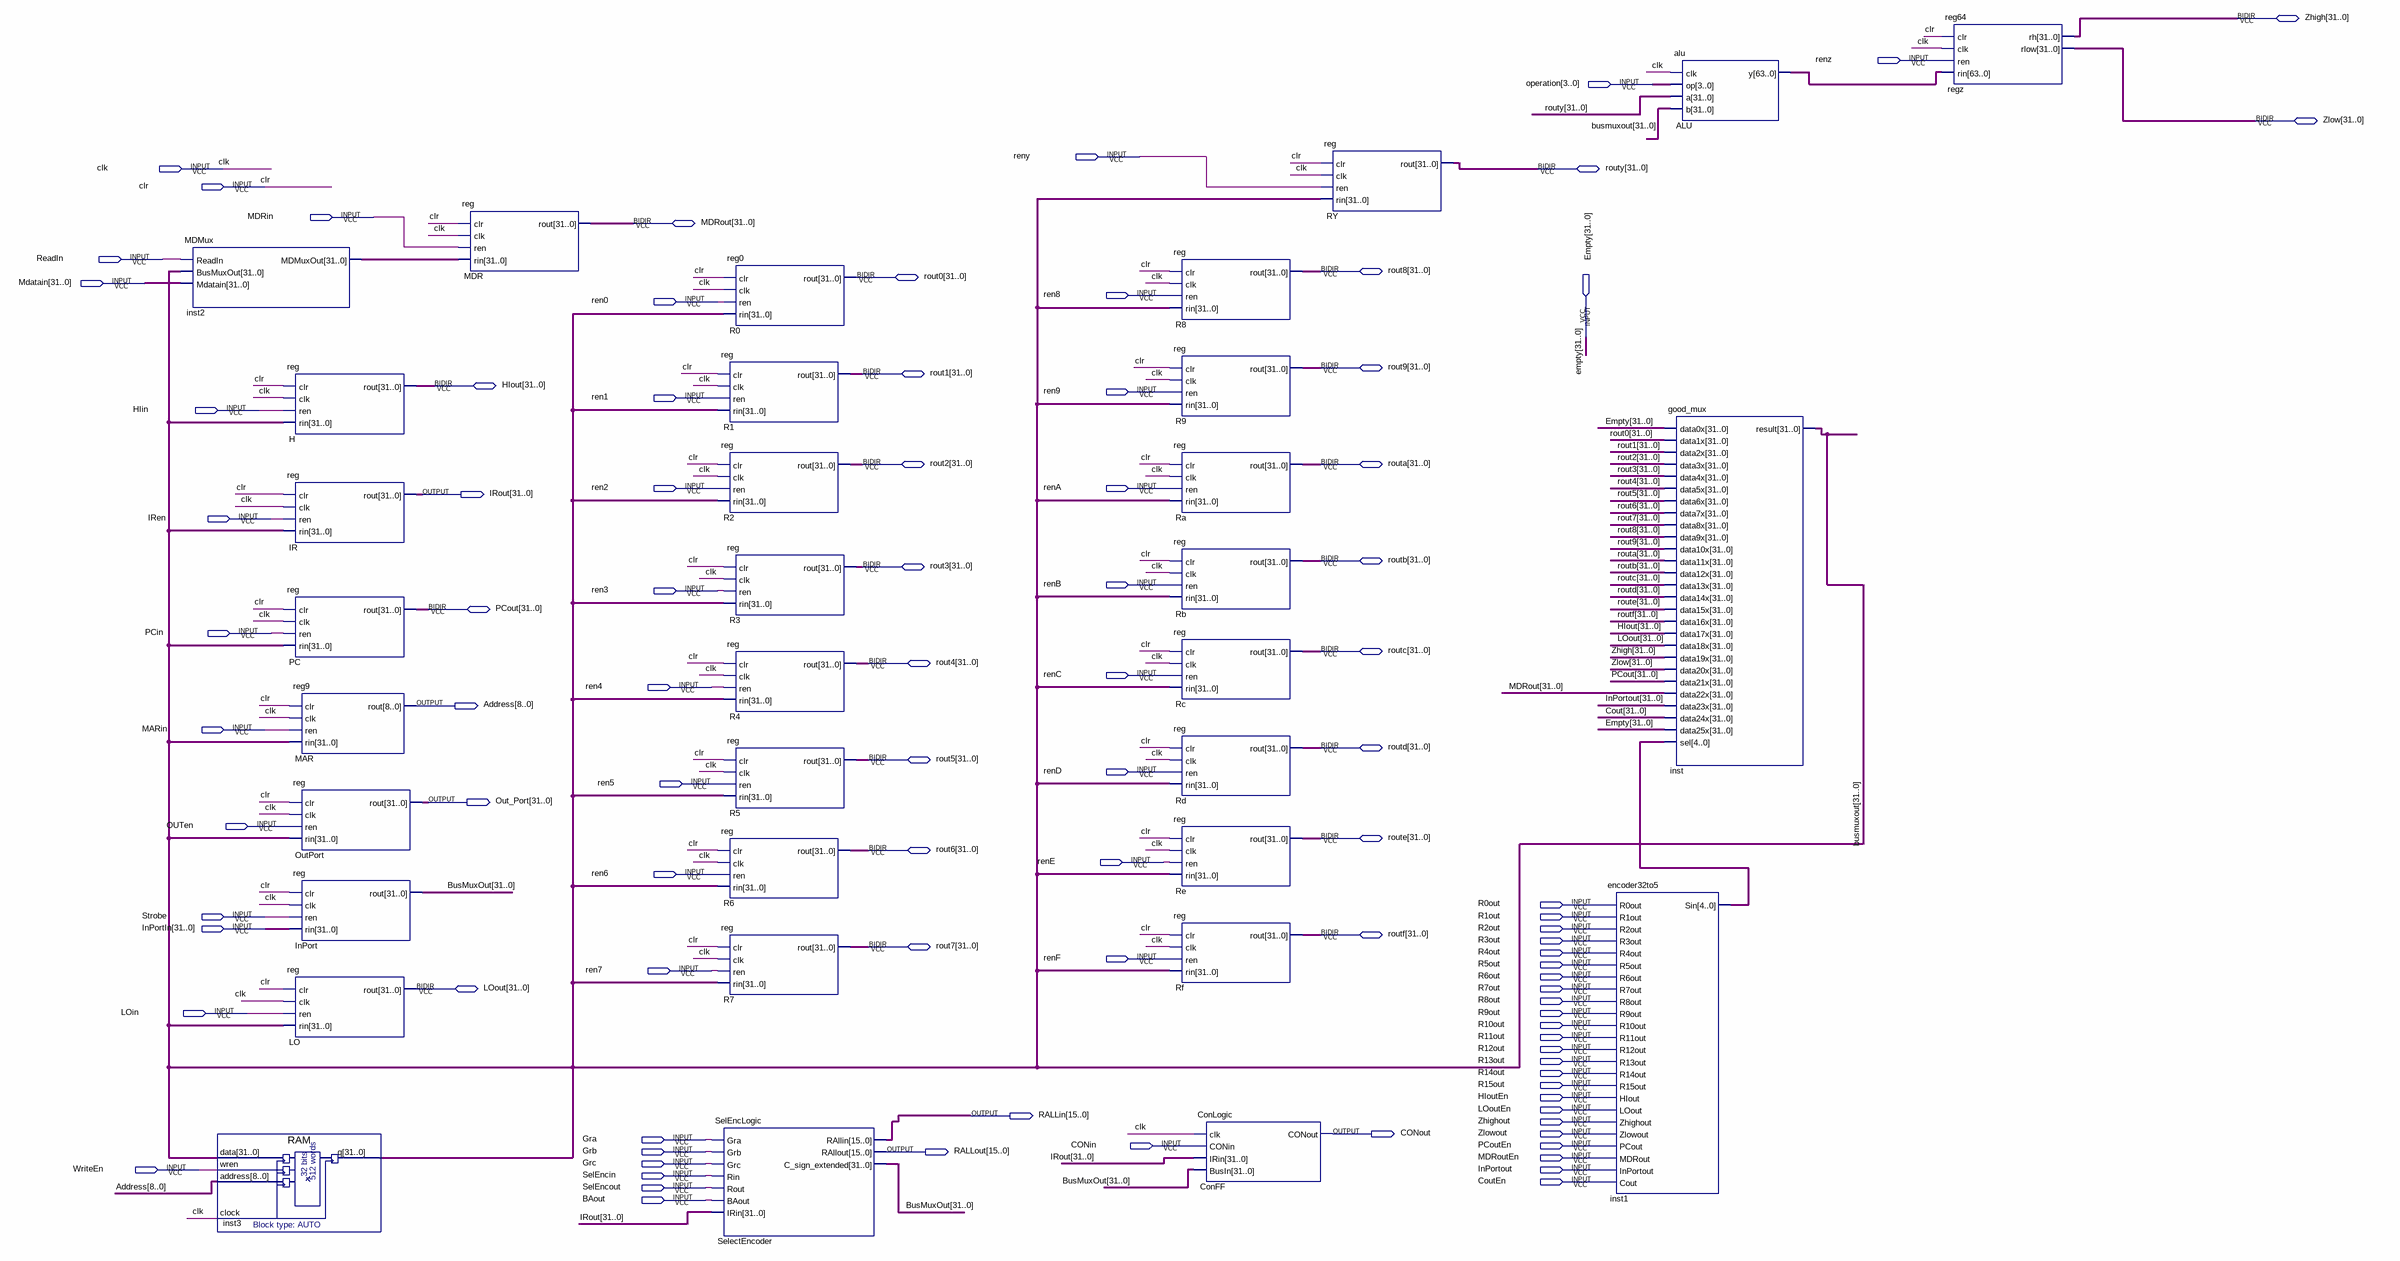
[diagram p0: schematic sheet]
// Quartus schematic ELEC374.bdf as structural Verilog: 33 symbols, 94 pins
module ELEC374 (
  input  renz,
  input  [3:0] operation,
  input  reny,
  input  clk,
  input  clr,
  input  MDRin,
  input  ReadIn,
  input  [31:0] Mdatain,
  input  ren8,
  input  ren0,
  input  [31:0] Empty,
  input  ren9,
  input  ren1,
  input  HIin,
  input  ren2,
  input  renA,
  input  IRen,
  input  renB,
  input  ren3,
  input  PCin,
  input  renC,
  input  ren4,
  input  MARin,
  input  renD,
  input  ren5,
  input  OUTen,
  input  renE,
  input  ren6,
  input  R0out,
  input  Strobe,
  input  R1out,
  input  [31:0] InPortIn,
  input  R2out,
  input  R3out,
  input  R4out,
  input  renF,
  input  R5out,
  input  ren7,
  input  R6out,
  input  R7out,
  input  R8out,
  input  LOin,
  input  R9out,
  input  R10out,
  input  R11out,
  input  R12out,
  input  R13out,
  input  R14out,
  input  R15out,
  input  HIoutEn,
  input  LOoutEn,
  input  Zhighout,
  input  Zlowout,
  input  Gra,
  input  CONin,
  input  PCoutEn,
  input  Grb,
  input  MDRoutEn,
  input  Grc,
  input  WriteEn,
  input  InPortout,
  input  SelEncin,
  input  CoutEn,
  input  SelEncout,
  input  BAout,
  inout  [31:0] Zhigh,
  inout  [31:0] Zlow,
  inout  [31:0] routy,
  inout  [31:0] MDRout,
  inout  [31:0] rout8,
  inout  [31:0] rout0,
  inout  [31:0] rout9,
  inout  [31:0] rout1,
  inout  [31:0] HIout,
  inout  [31:0] rout2,
  inout  [31:0] routa,
  inout  [31:0] routb,
  inout  [31:0] rout3,
  inout  [31:0] PCout,
  inout  [31:0] routc,
  inout  [31:0] rout4,
  inout  [31:0] routd,
  inout  [31:0] rout5,
  inout  [31:0] route,
  inout  [31:0] rout6,
  inout  [31:0] routf,
  inout  [31:0] rout7,
  inout  [31:0] LOout,
  output [31:0] IRout,
  output [8:0] Address,
  output [31:0] Out_Port,
  output [15:0] RALLin,
  output CONout,
  output [15:0] RALLout
);

  wire [4:0] inst1_sin;
  wire [31:0] busmuxout, Cout, InPortout_bus, inst2_mdmuxout;
  wire [63:0] ALU_y;

  MDMux inst2 (.ReadIn(ReadIn), .BusMuxOut(busmuxout), .Mdatain(Mdatain), .MDMuxOut(inst2_mdmuxout));
  RAM inst3 (.data(busmuxout), .wren(WriteEn), .address(Address), .clock(clk), .q(busmuxout));
  \reg  H (.clr(clr), .clk(clk), .ren(HIin), .rin(busmuxout), .rout(HIout));
  \reg  IR (.clr(clr), .clk(clk), .ren(IRen), .rin(busmuxout), .rout(IRout));
  \reg  PC (.clr(clr), .clk(clk), .ren(PCin), .rin(busmuxout), .rout(PCout));
  \reg  LO (.clr(clr), .clk(clk), .ren(LOin), .rin(busmuxout), .rout(LOout));
  reg9 MAR (.clr(clr), .clk(clk), .ren(MARin), .rin(busmuxout), .rout(Address));
  \reg  OutPort (.clr(clr), .clk(clk), .ren(OUTen), .rin(busmuxout), .rout(Out_Port));
  \reg  InPort (.clr(clr), .clk(clk), .ren(Strobe), .rin(InPortIn), .rout(busmuxout));
  \reg  MDR (.clr(clr), .clk(clk), .ren(MDRin), .rin(inst2_mdmuxout), .rout(MDRout));
  \reg  R1 (.clr(clr), .clk(clk), .ren(ren1), .rin(busmuxout), .rout(rout1));
  \reg  R2 (.clr(clr), .clk(clk), .ren(ren2), .rin(busmuxout), .rout(rout2));
  \reg  R6 (.clr(clr), .clk(clk), .ren(ren6), .rin(busmuxout), .rout(rout6));
  \reg  R7 (.clr(clr), .clk(clk), .ren(ren7), .rin(busmuxout), .rout(rout7));
  SelEncLogic SelectEncoder (
    .Gra(Gra), .Grb(Grb), .Grc(Grc), .Rin(SelEncin), .Rout(SelEncout), .BAout(BAout), .IRin(IRout),
    .RAllin(RALLin), .RAllout(RALLout), .C_sign_extended(busmuxout));
  reg0 R0 (.clr(clr), .clk(clk), .ren(ren0), .rin(busmuxout), .rout(rout0));
  \reg  R3 (.clr(clr), .clk(clk), .ren(ren3), .rin(busmuxout), .rout(rout3));
  \reg  R4 (.clr(clr), .clk(clk), .ren(ren4), .rin(busmuxout), .rout(rout4));
  \reg  R5 (.clr(clr), .clk(clk), .ren(ren5), .rin(busmuxout), .rout(rout5));
  \reg  R8 (.clr(clr), .clk(clk), .ren(ren8), .rin(busmuxout), .rout(rout8));
  \reg  R9 (.clr(clr), .clk(clk), .ren(ren9), .rin(busmuxout), .rout(rout9));
  \reg  Ra (.clr(clr), .clk(clk), .ren(renA), .rin(busmuxout), .rout(routa));
  \reg  Rb (.clr(clr), .clk(clk), .ren(renB), .rin(busmuxout), .rout(routb));
  \reg  Rc (.clr(clr), .clk(clk), .ren(renC), .rin(busmuxout), .rout(routc));
  \reg  Rd (.clr(clr), .clk(clk), .ren(renD), .rin(busmuxout), .rout(routd));
  \reg  Re (.clr(clr), .clk(clk), .ren(renE), .rin(busmuxout), .rout(route));
  \reg  Rf (.clr(clr), .clk(clk), .ren(renF), .rin(busmuxout), .rout(routf));
  ConLogic ConFF (.clk(clk), .CONin(CONin), .IRin(IRout), .BusIn(busmuxout), .CONout(CONout));
  \reg  RY (.clr(clr), .clk(clk), .ren(reny), .rin(busmuxout), .rout(routy));
  encoder32to5 inst1 (
    .R0out(R0out), .R1out(R1out), .R2out(R2out), .R3out(R3out), .R4out(R4out), .R5out(R5out), .R6out(R6out),
    .R7out(R7out), .R8out(R8out), .R9out(R9out), .R10out(R10out), .R11out(R11out), .R12out(R12out),
    .R13out(R13out), .R14out(R14out), .R15out(R15out), .HIout(HIoutEn), .LOout(LOoutEn), .Zhighout(Zhighout),
    .Zlowout(Zlowout), .PCout(PCoutEn), .MDRout(MDRoutEn), .InPortout(InPortout), .Cout(CoutEn),
    .Sin(inst1_sin));
  alu ALU (.clk(clk), .op(operation), .a(routy), .b(busmuxout), .y(ALU_y));
  good_mux inst (
    .data0x(Empty), .data1x(rout0), .data2x(rout1), .data3x(rout2), .data4x(rout3), .data5x(rout4),
    .data6x(rout5), .data7x(rout6), .data8x(rout7), .data9x(rout8), .data10x(rout9), .data11x(routa),
    .data12x(routb), .data13x(routc), .data14x(routd), .data15x(route), .data16x(routf), .data17x(HIout),
    .data18x(LOout), .data19x(Zhigh), .data20x(Zlow), .data21x(PCout), .data22x(MDRout),
    .data23x(InPortout_bus), .data24x(Cout), .data25x(Empty), .sel(inst1_sin), .result(busmuxout));
  reg64 regz (.clr(clr), .clk(clk), .ren(renz), .rin(ALU_y), .rh(Zhigh), .rlow(Zlow));
endmodule
